# EAGLE design I2CGPS (EAGLE 7.6.0)
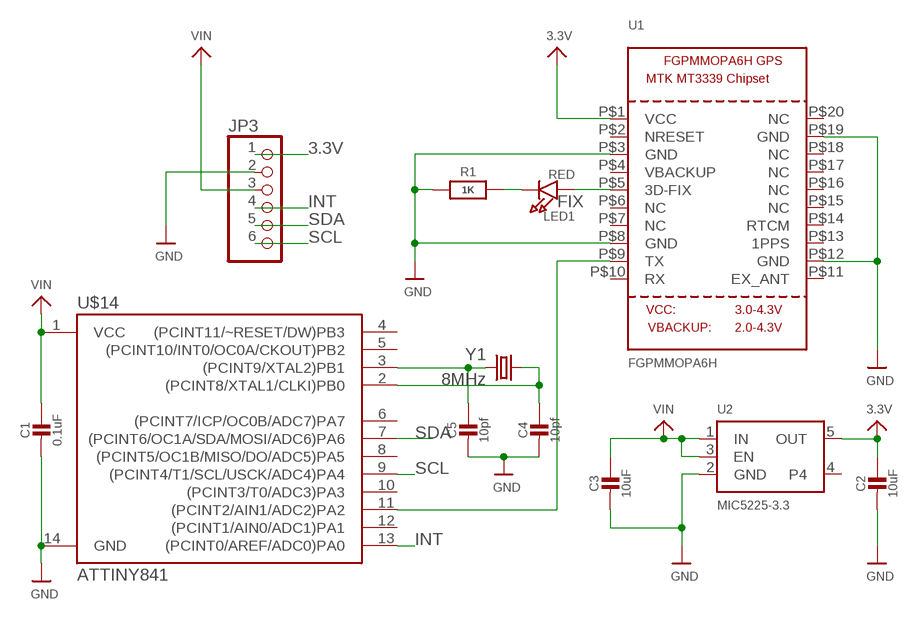
[diagram p0: schematic, sheet 1]

## Parts
C1  0.1uF  CAP_CERAMIC0805-NOOUTLINE  [0805-NO]
C2  10uF  CAP_CERAMIC0805-NOOUTLINE  [0805-NO]
C3  10uF  CAP_CERAMIC0805-NOOUTLINE  [0805-NO]
C4  10pf  CAP_CERAMIC0805-NOOUTLINE  [0805-NO]
C5  10pf  CAP_CERAMIC0805-NOOUTLINE  [0805-NO]
JP3  PINHD-1X6CB  [1X06-CLEANBIG]
LED1  RED  LED0805_NOOUTLINE  [CHIPLED_0805_NOOUTLINE]
R1  1K  RESISTOR0805_NOOUTLINE  [0805-NO]
U1  FGPMMOPA6H  GPS_FGPMMOPA6H  [FGPMMOPA6H]
U2  MIC5225-3.3  VREG_SOT23-5  [SOT23-5]
U$14  ATTINY841  ATTINY84  [SO14]
Y1  8MHz  CRYSTALCRYSTAL-SMD-5X3-12MHZ  [CRYSTAL-SMD-5X3]

## Nets
3.3V: C2.1 JP3.1 U1.P$1(VCC) U2.5(OUT)
FIX: LED1.A U1.P$5(3D-FIX)
GND: C1.2 C2.2 C3.2 C4.2 C5.2 JP3.2 R1.1 U1.P$3(GND) U1.P$8(GND) U1.P$12(GND) U1.P$19(GND) U2.2(GND) U$14.14(GND)
INT: JP3.4 U$14.13((PCINT0/AREF/ADC0)PA0)
N$1: C4.1 U$14.2((PCINT8/XTAL1/CLKI)PB0) Y1.1
N$2: LED1.C R1.2
N$3: C5.1 U$14.3((PCINT9/XTAL2)PB1) Y1.3
SCL: JP3.6 U$14.9((PCINT4/T1/SCL/USCK/ADC4)PA4)
SDA: JP3.5 U$14.7((PCINT6/OC1A/SDA/MOSI/ADC6)PA6)
TX: U1.P$9(TX) U$14.11((PCINT2/AIN1/ADC2)PA2)
VIN: C1.1 C3.1 JP3.3 U2.1(IN) U2.3(EN) U$14.1(VCC)
Unconnected: U1.P$2(NRESET) U1.P$4(VBACKUP) U1.P$6(NC) U1.P$7(NC) U1.P$10(RX) U1.P$11(EX_ANT) U1.P$13(1PPS) U1.P$14(RTCM) U1.P$15(NC) U1.P$16(NC) U1.P$17(NC) U1.P$18(NC) U1.P$20(NC) U2.4 U$14.4((PCINT11/~RESET/DW)PB3) U$14.5((PCINT10/INT0/OC0A/CKOUT)PB2) U$14.6((PCINT7/ICP/OC0B/ADC7)PA7) U$14.8((PCINT5/OC1B/MISO/DO/ADC5)PA5) U$14.10((PCINT3/T0/ADC3)PA3) U$14.12((PCINT1/AIN0/ADC1)PA1)

## Library data of the parts
C1-C5 = microbuilder:CAP_CERAMIC: Ceramic Capacitors For new designs, use the packages preceded by an '_' character since they are more reliable: The following footprints should be used on most boards: _0402 - Standard footprint for regular board layouts _0603 - Standard footprint for regular board layouts _0805 - Standard footprint for regular board layouts _1206 - Standard footprint for regular board layouts For extremely tight-pitch boards where space is at a premium, the following 'micro-pitch' footprints can be used (smaller pads, no silkscreen outline, etc.): _0402MP - Micro-pitch footprint for very dense/compact boards _0603MP - Micro-pitch footprint for very dense/compact boards _0805MP - Micro-pitch footprint for very dense/compact boards _1206MP - Micro-pitch footprint for very dense/compact boards
JP3 = adafruit:PINHD-1X6: PIN HEADER
LED1 = microbuilder:LED: LED 0603 - 0603 Surface Mount Package 2mA: Green LED - Low Power (3.9mcd, 2ma, 1.7Vf) - Digikey: 475-2709-2-ND Orange LED - Low Power (9.8mcd, 2ma, 1.8Vf) - Digikey: 475-1194-2-ND Red LED - Low Power (5mcd, 2ma, 1.8Vf) - Digikey: 475-1195-2-ND Yellow LED - Low Power (7mcd, 2ma, 1.8Vf) - Digikey: 475-1196-2-ND 5mA: Blue LED - Low Power (17mcd, 5ma, 2.9Vf) - Digikey: LNJ937W8CRACT-ND 0805 - 0805 Surface Mount Package 2mA: Red LED (8.8mcd, 2mA, 1.8Vf, Clear) - Low Power [Digikey: 475-2510-1-ND] Green LED (5mcd, 2mA, 1.8Vf, Clear) - Low Power [Digikey: 475-2730-1-ND] Yellow LED (11.3mcd, 2mA, 1.8Vf, Clear) - Low Power [Digikey: 475-2555-1-ND] 20mA: Red LED (104mcd, 20mA, Diffused) - LS R976 [Digikey: 475-1278-6-ND] Red LED (12mcd, 20mA, 2.0Vf, Clear) - APT2012EC [Digikey: 754-1128-1-ND] Green LED (15mcd, 20mA, 2.2Vf, Clear) - APT2012GC [Digikey: 754-1131-1-ND] Orange LED (160mcd, 20mA, 2.1Vf, Clear) - APT2012SECK [Digikey: 754-1130-1-ND] 1206 - 1206 Surface Mount Package Green LED (26mcd, 20mA, Diffused) - LG N971 [Digikey: 475-1407-6-ND] Red LED (15mcd, 20mA, Diffused) - LH N974 [Digikey: 475-1416-6-ND]
R1 = microbuilder:RESISTOR: Resistors For new designs, use the packages preceded by an '_' character since they are more reliable: The following footprints should be used on most boards: _0402 - Standard footprint for regular board layouts _0603 - Standard footprint for regular board layouts _0805 - Standard footprint for regular board layouts _1206 - Standard footprint for regular board layouts For extremely tight-pitch boards where space is at a premium, the following 'micro-pitch' footprints can be used (smaller pads, no silkscreen outline, etc.): _0402MP - Micro-pitch footprint for very dense/compact boards _0603MP - Micro-pitch footprint for very dense/compact boards _0805MP - Micro-pitch footprint for very dense/compact boards _1206MP - Micro-pitch footprint for very dense/compact boards
U1 = microbuilder:GPS_FGPMMOPA6H: GPS Module - MTK MT3339 Chipset, -165dBm sensitivity, 22 channels, 10Hz, auto-select external antenna options
U2 = microbuilder:VREG_SOT23-5: SOT23-5 Fixed Voltage Regulators Part Current Out V Out V In V Dropout θJA (°C/W) TJ (°C) Digikey Part No. ADP121 150mA 3.3V 3.4-5.5V 0.09V @ 150mA -- -- ADP121-AUJZ33R7CT-ND ADP121 150mA 3.0V 3.1-5.5V 0.09V @ 150mA -- -- ADP121-AUJZ30R7CT-ND ADP122 300mA 3.3V 3.4-5.5V 0.085V @ 300mA -- -- ADP122AUJZ-3.3-R7CT-ND ADP1712 300mA 3.3V 3.5-5.5V 0.17V @ 300mA -- -- ADP1712AUJZ-3.3-R7TR-ND AP7311 (Low Cost) 150mA 3.3V 3.5-6V 0.15V @ 150mA -- -- AP7311-33WG-7DICT-ND LD39015M18R 150mA 1.8V 1.9V-5.5V 0.08V @ 100mA -- -- 497-6977-1-ND LP2985A-33DBVR 150mA 3.3V 3.3-16V 0.28V @ 150mA 206 150 296-18479-1-ND MCP1824T-3302E/OT 300mA 3.3V 3.5V-6V 0.2V @ 300mA -- -- MCP1824T-3302E/OTCT-ND MIC5205-2.5YM5 TR 150mA 2.5V 2.7-16V 0.165V @ 150mA -- -- 576-1257-2-ND MIC5205-3.0YM5 TR 150mA 3.0V 3.2V-16V 0.165V @ 150mA -- -- 576-1258-2-ND MIC5205-3.3YM5 TR 150mA 3.3V 3.5V-16V 0.165V @ 150mA -- -- 576-1259-2-ND TPS780330220 150mA 3.3V+2.2V 3.6-5.5V 250mV Max -- -- 296-23332-1-ND TDA3663/N1,135 100mA 3.3V 3.5-45V 0.18V @ 50mA -- -- 568-5343-1-ND Max operating temp can be calculated using θJA, TJ (max junction temperature), and power in watts. Set the "Maximum Ambient Temperature" until it reaches TJ ("Max Junction Temperature"), which is the absolute limit for safe use of the regulator: Heat Sink Temperature Calculator <http://www.daycounter.com/Calculators/Heat-Sink-Temperature-Calculator.phtml> For example, With 12V source into a 3.3V LP2985 and a 30mA load, we are dissipating (12V-3.3V) * 0.03A = 0.261W. With a θJA of 206 °C/W, a TJ of 150°C, and 261mW we can safely use the chip without a heat sink up to 75°C (=147.1°C Junction Temperature).
U$14 = SparkFun-DigitalIC:ATTINY84: Atmel 14-pin 2/4/8kB flash uC; PROD_ID: IC-11285
Y1 = SparkFun-FreqCtrl:CRYSTAL: Various standard crystals. Proven footprints.; PROD_ID: XTAL-08297; VALUE: 12MHz

## Board
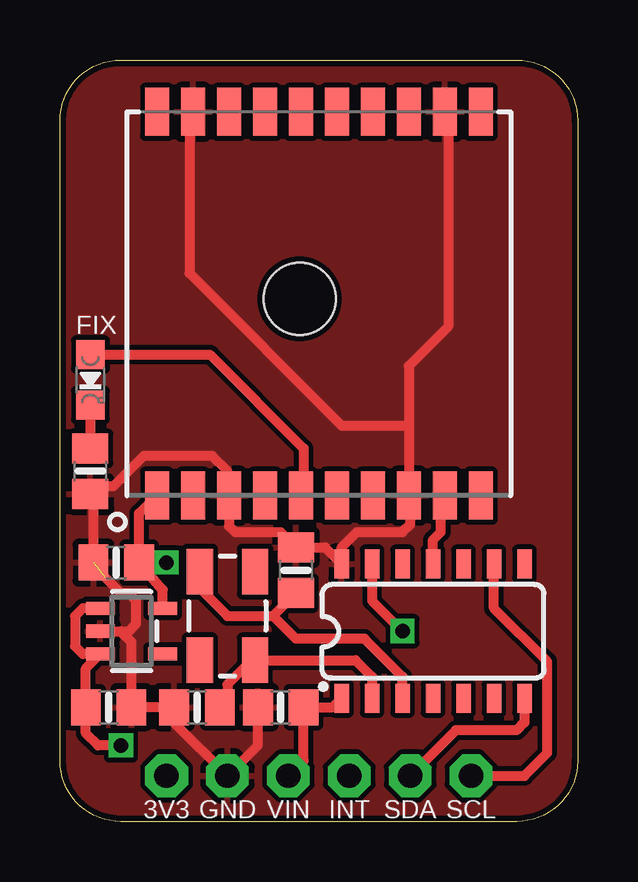
[diagram p1: board, top side]
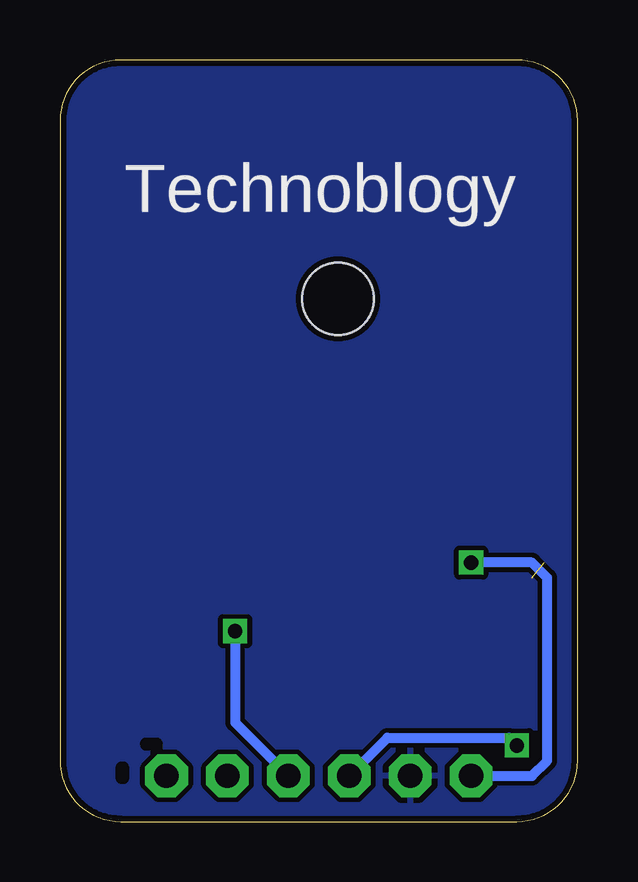
[diagram p2: board, bottom side, seen from below]

Size 21.59 x 31.75 mm. Coordinates in mm from the lower left corner, seen from the top.
Outline: 0,2.54 0,29.21 arc-90 2.54,31.75 19.05,31.75 arc-90 21.59,29.21 21.59,2.54 arc-90 19.05,0 2.54,0 arc-90 0,2.54
Copper layers (1*16): Top 0.035mm / dielectric 1.5mm / Bottom 0.035mm
Design rules "adafruit *": minimum track width 8mil, minimum drill 15.5mil, track to track 8mil, track to pad 8mil, pad to pad 8mil, via to via 8mil, smd to smd 8mil, copper to edge 10mil, drill to drill 8mil, minimum pad ring 10mil, minimum via ring 8mil, stop-mask expansion 2mil, vias tented up to drill 20mil, thermal gap 10mil
bRestrict: area 17.5,3.2 to 18,3.3; area 16.5,1.8 to 16.6,2.3; area 18.9,1.8 to 19.1,2.3

### Footprints (pad centres in the part's own frame; a part is rotated, then mirrored left to right if it is on the bottom)
0805-NO = smd 1.24 x 1.5: 1 -0.95,0; 2 0.95,0
1X06-CLEANBIG = drill 1.016 pad 1.778 octagon: 1 -6.35,0; 2 -3.81,0; 3 -1.27,0; 4 1.27,0; 5 3.81,0; 6 6.35,0
CHIPLED_0805_NOOUTLINE = smd 1.2 x 1.2: A 0,-1.05; C 0,1.05
FGPMMOPA6H = smd 2 x 1: P$1 -8,6.75; P$2 -8,5.25; P$3 -8,3.75; P$4 -8,2.25; P$5 -8,0.75; P$6 -8,-0.75; P$7 -8,-2.25; P$8 -8,-3.75; P$9 -8,-5.25; P$10 -8,-6.75; P$11 8,-6.75; P$12 8,-5.25; P$13 8,-3.75; P$14 8,-2.25; P$15 8,-0.75; P$16 8,0.75; P$17 8,2.25; P$18 8,3.75; P$19 8,5.25; P$20 8,6.75 | hole 3: 0.2,0.8
SOT23-5 = smd 0.55 x 1.2: 1 -0.95,-1.3; 2 0,-1.3; 3 0.95,-1.3; 4 0.95,1.3; 5 -0.95,1.3
SO14 = smd 0.6 x 1.2: 1 -3.81,-2.8; 2 -2.54,-2.8; 3 -1.27,-2.8; 4 0,-2.8; 5 1.27,-2.8; 6 2.54,-2.8; 7 3.81,-2.8; 8 3.81,2.8; 9 2.54,2.8; 10 1.27,2.8; 11 0,2.8; 12 -1.27,2.8; 13 -2.54,2.8; 14 -3.81,2.8
CRYSTAL-SMD-5X3 = smd 1.9 x 1.1: 1 -1.85,-1.15; 2 1.85,-1.15; 3 1.85,1.15; 4 -1.85,1.15

### Placement (x,y rotation side)
C1  9.21,4.76 180 top
C2  2.35,10.79 180 top
C3  2.03,4.76 0 top
C4  5.71,4.76 180 top
C5  9.84,10.48 90 top
JP3  10.79,1.91 0 top
LED1  1.27,18.41 180 top
R1  1.27,14.61 90 top
U1  10.79,21.59 90 top
U2  2.98,7.94 270 top
U$14  15.56,7.94 0 top
Y1  6.99,8.57 90 top

### Tracks (layer width: path | path; a pad name or v marks a point on that pad's centre or on a via)
3.3V  (via drill 0.6)
  Top 0.406: U2.5 4.29,9.66 C2.1 3.3,11.43 | 3.3,11.43 3.3,12.85 U1.P$1 | v4.45,10.79 3.93,10.79 3.3,11.43
  Bottom 0.406: JP3.1 1.91,1.91 1.27,2.54 1.27,10.16 1.91,10.79 v4.45,10.79
FIX
  Top 0.406: LED1.A 6.25,19.46 10.16,15.56 10.16,13.71 U1.P$5
GND  (1 unrouted)
  Top 0.406: U1.P$12 16.19,29.44 16.19,20.64 14.54,18.99 14.54,16.51 | 14.54,16.51 U1.P$8 14.61,13.53 14.61,12.38 14.29,12.06 12.38,12.06 11.75,11.43 U$14.14 11.06,11.43 C5.2 9.21,12.06 7.3,12.06 7.04,12.32 U1.P$3 6.99,13.53 6.99,14.61 6.35,15.24 3.49,15.24 2.22,13.97 1.58,13.97 R1.1 1.4,13.53 C2.2 | U1.P$19 5.4,29.44 5.4,22.86 11.75,16.51 14.54,16.51 | U2.2 2.54,7.94 | 1.91,10.16 2.54,9.53 2.86,9.53 3.17,9.21 3.17,8.26 2.86,7.94 2.54,7.94 | 2.54,7.94 2.98,7.5 C3.2 C4.2 4.76,4.12 JP3.2 8.26,3.18 C1.2
  pour Top (isolate 0.203): 0,0 0,31.7 21.59,31.7 21.59,0
  pour Bottom (isolate 0.203): 0,0 0,31.7 21.59,31.7 21.59,0
INT  (via drill 0.6)
  Top 0.406: v14.29,7.94 13.02,9.21 U$14.13
  Bottom 0.406: v14.29,7.94 14.29,4.13 JP3.4
N$1
  Top 0.406: C4.1 6.99,5.08 6.99,5.71 7.99,6.72 Y1.1 12.33,6.72 13.02,6.03 U$14.2
N$2
  Top 0.406: LED1.C R1.2
N$3
  Top 0.406: Y1.3 5.83,9.72 6.99,8.57 8.89,8.57 | C5.1 8.89,8.57 | U$14.3 14.29,6.03 12.7,7.62 9.84,7.62 8.89,8.57
SCL
  Top 0.406: U$14.9 18.1,8.89 20.32,6.67 20.32,2.86 19.37,1.91 JP3.6
SDA
  Top 0.406: JP3.5 16.51,3.81 19.05,3.81 19.37,4.13 U$14.7
TX
  Top 0.406: U$14.11 15.56,11.75 15.88,12.06 15.88,13.42 U1.P$9
VIN  (via drill 0.6)
  Top 0.406: U2.1 0.95,8.89 0.64,8.57 0.64,7.3 0.95,6.99 U2.3 1.08,6.38 C3.1 1.08,3.68 1.59,3.17 v2.54,3.17 | U$14.1 11.37,4.76 C1.1 10.16,2.54 JP3.3
  Bottom 0.406: JP3.3 7.94,3.49 2.86,3.49 v2.54,3.17

### Text on the board
tPlace: FIX | 3V3 | GND | VIN | INT | SDA | SCL
bPlace: Technoblogy